# EAGLE design grizzly_bear (EAGLE 7.4.0)
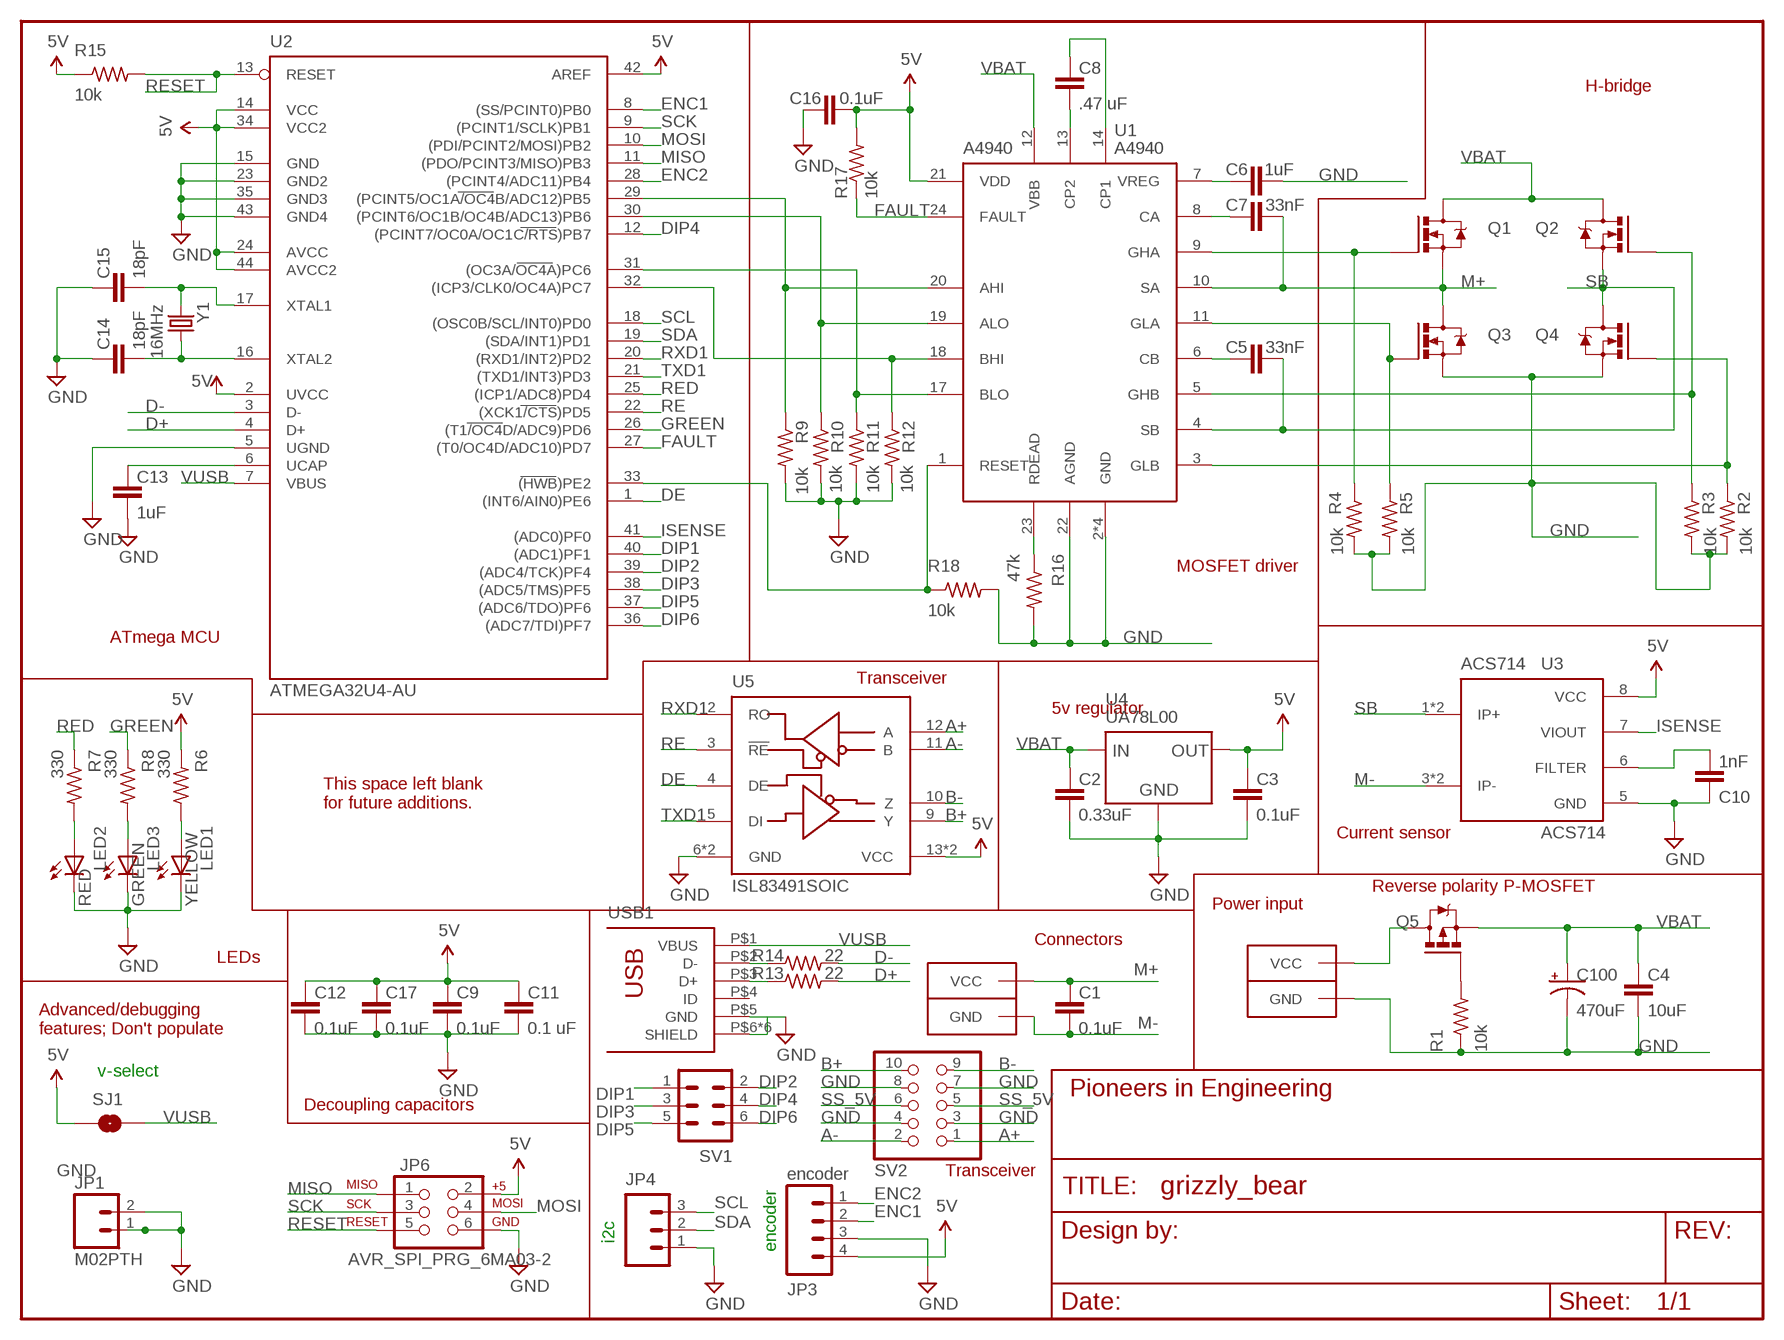
[diagram p0: schematic, sheet 1]
FRAME1 (FRAME-LETTER): AUTHOR: K. Mann, J. Chenn, R. Ou, J. Jacinto, S. Ghosh; REVISION: 4A

## Parts
C1  0.1uF  CAP0603-CAP  [0603-CAP]
C2  0.33uF  CAP0603-CAP  [0603-CAP]
C3  0.1uF  CAP0603-CAP  [0603-CAP]
C4  10uF  CAP1206  [1206]
C5  33nF  CAP0603-CAP  [0603-CAP]
C6  1uF  CAP0603-CAP  [0603-CAP]
C7  33nF  CAP0603-CAP  [0603-CAP]
C8  .47 uF  CAP0603-CAP  [0603-CAP]
C9  0.1uF  CAP0603-CAP  [0603-CAP]
C10  1nF  CAP0603-CAP  [0603-CAP]
C11  0.1 uF  CAP0603-CAP  [0603-CAP]
C12  0.1uF  CAP0603-CAP  [0603-CAP]
C13  1uF  CAP0603-CAP  [0603-CAP]
C14  18pF  CAP0603-CAP  [0603-CAP]
C15  18pF  CAP0603-CAP  [0603-CAP]
C16  0.1uF  CAP0603-CAP  [0603-CAP]
C17  0.1uF  CAP0603-CAP  [0603-CAP]
C100  470uF  CAP_POLG  [PANASONIC_G]
JP1  M02PTH  [1X02]
JP3  encoder  M041X04-MTA  [1X04-MTA]
JP4  M031X03-MTA  [1X03-MTA]
JP6  AVR_SPI_PRG_6MA03-2  [MA03-2]
LED1  YELLOW  LED0805  [LED-0805]
LED2  RED  LED0805  [LED-0805]
LED3  GREEN  LED0805  [LED-0805]
Q1  PSMN4R0  N-CHANNEL-MOSFETSOT669  [SOT669]
Q2  PSMN4R0  N-CHANNEL-MOSFETSOT669  [SOT669]
Q3  PSMN4R0  N-CHANNEL-MOSFETSOT669  [SOT669]
Q4  PSMN4R0  N-CHANNEL-MOSFETSOT669  [SOT669]
Q5  IPD90P03P4L  P-CHANNEL-MOSFETTO252  [TO252]
R1  10k  R-US_R0603  [R0603]
R2  10k  R-US_R0603  [R0603]
R3  10k  R-US_R0603  [R0603]
R4  10k  R-US_R0603  [R0603]
R5  10k  R-US_R0603  [R0603]
R6  330  R-US_R0603  [R0603]
R7  330  R-US_R0603  [R0603]
R8  330  R-US_R0603  [R0603]
R9  10k  R-US_R0603  [R0603]
R10  10k  R-US_R0603  [R0603]
R11  10k  R-US_R0603  [R0603]
R12  10k  R-US_R0603  [R0603]
R13  22  R-US_R0603  [R0603]
R14  22  R-US_R0603  [R0603]
R15  10k  R-US_R0603  [R0603]
R16  47k  R-US_R0603  [R0603]
R17  10k  R-US_R0603  [R0603]
R18  10k  R-US_R0603  [R0603]
SJ1  SOLDERJUMPERNO  [SJ_2S-NO]
SV1  MA03-2  [MA03-2]
SV2  SENSOR_CON_5PINPTH-SHROUDED  [2X5_SHROUDED]
U1  A4940  [24-PIN_TSSOP]
U2  ATMEGA32U4-AU  [TQFP44]
U3  ACS714  [8-PIN_SOIC]
U4  UA78L00  [SOT-89-3]
U5  ISL83491SOIC  [SOIC14]
U$18  ANDERSONVERTICAL  [ANDERSON_VERTICAL]
U$19  ANDERSONVERTICAL  [ANDERSON_VERTICAL]
USB1  USB-OTGMICRO-AB  [USB-MICRO-AB]
Y1  16MHz  CRYSTALSMD  [HC49UP]

## Nets
5V: C3.1 C9.1 C11.2 C12.1 C16.1 C17.1 JP3.4 JP6.2 R6.2 R15.1 R17.2 SJ1.1 U1.21(VDD) U2.2(UVCC) U2.14(VCC) U2.24(AVCC) U2.34(VCC2) U2.42(AREF) U2.44(AVCC2) U3.8(VCC) U4.OUTPUT(OUT) U5.13(VCC) U5.14(VCC)
A+: SV2.1 U5.12(A)
A-: SV2.2 U5.11(B)
AHI: R9.1 U1.20(AHI) U2.29((PCINT5/OC1A/OC4B/ADC12)PB5)
ALO: R10.1 U1.19(ALO) U2.30((PCINT6/OC1B/OC4B/ADC13)PB6)
B+: SV2.10 U5.9(Y)
B-: SV2.9 U5.10(Z)
BHI: R12.1 U1.18(BHI) U2.32((ICP3/CLK0/OC4A)PC7)
BLO: R11.1 U1.17(BLO) U2.31((OC3A/OC4A)PC6)
CA: C7.1 U1.8(CA)
CB: C5.2 U1.6(CB)
CP1: C8.1 U1.14(CP1)
CP2: C8.2 U1.13(CP2)
D+: R13.2 U2.4(D+)
D+-_CON: R13.1 USB1.P$3(D+)
D-: R14.2 U2.3(D-)
D-_CON: R14.1 USB1.P$2(D-)
DE: U2.1((INT6/AIN0)PE6) U5.4(DE)
DIP1: SV1.1 U2.40((ADC1)PF1)
DIP2: SV1.2 U2.39((ADC4/TCK)PF4)
DIP3: SV1.3 U2.38((ADC5/TMS)PF5)
DIP4: SV1.4 U2.12((PCINT7/OC0A/OC1C/RTS)PB7)
DIP5: SV1.5 U2.37((ADC6/TDO)PF6)
DIP6: SV1.6 U2.36((ADC7/TDI)PF7)
DRIVER-RESET: R18.1 U1.1(RESET) U2.33((HWB)PE2)
ENC1: JP3.2 U2.8((SS/PCINT0)PB0)
ENC2: JP3.1 U2.28((PCINT4/ADC11)PB4)
FAULT: R17.1 U1.24(FAULT) U2.27((T0/OC4D/ADC10)PD7)
FILTER: C10.2 U3.6(FILTER)
GHA: Q1.4(G) R4.1 U1.9(GHA)
GHB: Q2.4(G) R3.1 U1.5(GHB)
GLA: Q3.4(G) R5.1 U1.11(GLA)
GLB: Q4.4(G) R2.1 U1.3(GLB)
GND: C2.2 C3.2 C4.1 C6.2 C9.2 C10.1 C11.1 C12.2 C13.2 C14.1 C15.1 C16.2 C17.2 C100.- JP1.1 JP1.2 JP3.3 JP4.1 JP6.6 LED1.C LED2.C LED3.C Q3.1(S) Q3.2(S) Q3.3(S) Q4.1(S) Q4.2(S) Q4.3(S) R1.1 R2.2 R3.2 R4.2 R5.2 R9.2 R10.2 R11.2 R12.2 R16.2 R18.2 SV2.3 SV2.4 SV2.7 SV2.8 U1.2(GND) U1.15(GND) U1.16(GND) U1.22(AGND) U1.PAD(GND) U2.5(UGND) U2.15(GND) U2.23(GND2) U2.35(GND3) U2.43(GND4) U3.5(GND) U4.COMMON(GND) U5.6(GND) U5.7(GND) U$18.PIN1(GND) USB1.P$5(GND) USB1.P$6(SHIELD) USB1.P$7(SHIELD) USB1.P$8(SHIELD) USB1.P$9(SHIELD) USB1.P$10(SHIELD) USB1.P$11(SHIELD)
GREEN: R8.1 U2.26((T1/OC4D/ADC9)PD6)
GREEN-LED: LED3.A R8.2
ISENSE: U2.41((ADC0)PF0) U3.7(VIOUT)
M+: C1.1 C7.2 Q1.1(S) Q1.2(S) Q1.3(S) Q3.MB(D) U1.10(SA) U$19.PIN2(VCC)
M-: C1.2 U3.3(IP-) U3.4(IP-) U$19.PIN1(GND)
MISO: JP6.1 U2.11((PDO/PCINT3/MISO)PB3)
MOSI: JP6.4 U2.10((PDI/PCINT2/MOSI)PB2)
POWER-LED: LED1.A R6.1
RDEAD: R16.1 U1.23(RDEAD)
RE: U2.22((XCK1/CTS)PD5) U5.3(!RE)
RED: R7.1 U2.25((ICP1/ADC8)PD4)
RED-LED: LED2.A R7.2
RESET: JP6.5 R15.2 U2.13(RESET)
RPP-GATE: Q5.1(G) R1.2
RXD1: U2.20((RXD1/INT2)PD2) U5.2(RO)
SB: C5.1 Q2.1(S) Q2.2(S) Q2.3(S) Q4.MB(D) U1.4(SB) U3.1(IP+) U3.2(IP+)
SCK: JP6.3 U2.9((PCINT1/SCLK)PB1)
SCL: JP4.3 U2.18((OSC0B/SCL/INT0)PD0)
SDA: JP4.2 U2.19((SDA/INT1)PD1)
SS_5V: SV2.5 SV2.6
TXD1: U2.21((TXD1/INT3)PD3) U5.5(DI)
UCAP: C13.1 U2.6(UCAP)
VBAT: C2.1 C4.2 C100.+ Q1.MB(D) Q2.MB(D) Q5.2(S) U1.12(VBB) U4.INPUT(IN)
VIN: Q5.3(D) U$18.PIN2(VCC)
VREG: C6.1 U1.7(VREG)
VUSB: SJ1.2 U2.7(VBUS) USB1.P$1(VBUS)
XTAL1: C15.2 U2.17(XTAL1) Y1.2
XTAL2: C14.2 U2.16(XTAL2) Y1.1
Unconnected: USB1.P$4(ID)

## Notes on the sheet
- H-bridge
- MOSFET driver
- ATmega MCU
- Transceiver
- 5v regulator
- This space left blank 
  for future additions.
- Current sensor
- Reverse polarity P-MOSFET
- Power input
- Connectors
- LEDs
- Advanced/debugging 
  features; Don't populate
- v-select
- Decoupling capacitors
- Transceiver
- i2c
- encoder

## Library data of the parts
C1-C17 = pie:CAP: Capacitor Standard 0603 ceramic capacitor, and 0.1" leaded capacitor.; PIE-INT-REF-NUM: CAPACITOR-GENERIC
C100 = pie:CAP_POL: Capacitor Polarized These are standard SMD and PTH capacitors. Normally 10uF, 47uF, and 100uF in electrolytic and tantalum varieties. Always verify the external diameter of the through hole cap, it varies with capacity, voltage, and manufacturer. The EIA devices should be standard.; PIE-INT-REF-NUM: CAPACITOR-GENERIC
JP1 = SparkFun-Connectors:M02: Standard 2-pin 0.1" header. Use with - straight break away headers ( PRT-00116) - right angle break away headers (PRT-00553) - swiss pins (PRT-00743) - machine pins (PRT-00117) - female headers (PRT-00115) Molex polarized connector foot print use with: PRT-08233 with associated crimp pins and housings. 2.54_SCREWTERM for use with PRT-10571. 3.5mm Screw Terminal footprints for PRT-08084 5mm Screw Terminal footprints for use with PRT-08432
JP3 = pie:M04: 4-pin 0.1-inch header and MTA connector; PIE-INT-REF-NUM: MTA
JP4 = pie:M03: 3-pin 0.1-inch header and MTA connector; PIE-INT-REF-NUM: MTA
JP6 = pie:AVR_SPI_PRG_6: AVR ISP 6 Pin This is the reduced ISP connector for AVR programming. Common on Arduino. This footprint will take up less PCB space and can be used with a 10-pin to 6-pin adapter such as SKU: BOB-08508; PIE-INT-REF-NUM: BULK-STOCK
LED1-LED3 = pie:LED: LEDs Standard schematic elements and footprints for 5mm, 3mm, 1206, and 0603 sized LEDs. 5mm - Spark Fun Electronics SKU : COM-00529 (and others); PIE-INT-REF-NUM: LED
Q1-Q4 = pie:N-CHANNEL-MOSFET: N-channel TrenchMOS (TM) logic level FET Source: SOT23-3: http://www.nxp.com/documents/data_sheet/BSS123.pdf SOT669: http://www.nxp.com/documents/data_sheet/PH7030L.pdf; PIE-DIGIKEY-PN-PRI: 568-6738-1-ND; PIE-INT-REF-NUM: NMOS
Q5 = pie:P-CHANNEL-MOSFET: P-Channel PowerTrench® MOSFET Source: FDD4141.pdf; PIE-DIGIKEY-PN-PRI: IPD90P03P4L-04INCT-ND; PIE-INT-REF-NUM: PMOS
R1-R18 = pie:R-US_: RESISTOR, American symbol; PIE-INT-REF-NUM: RESISTOR-GENERIC
SJ1 = pie:SOLDERJUMPER: Solder Jumper Standard SMD solder jumper. Used to automate production. Two varients : Normally Open and Normally Closed are the same, but have different paste layers. NC will have a large amount of paste and should jumper during reflow.; PIE-INT-REF-NUM: DNL
SV1 = pie:MA03-2: PIN HEADER; OC_FARNELL: unknown; OC_NEWARK: unknown; PIE-INT-REF-NUM: BULK-STOCK
SV2 = pie:SENSOR_CON_5PIN
U1 = pie:A4940; PIE-DIGIKEY-PN-PRI: 620-1319-1-ND; PIE-INT-REF-NUM: A4940
U2 = pie:ATMEGA32U4-AU; PIE-DIGIKEY-PN-ALT1: ATMEGA32U4-MURCT-ND; PIE-DIGIKEY-PN-PRI: ATMEGA32U4RC-MURCT-ND; PIE-INT-REF-NUM: ATmega32U4
U3 = pie:ACS714; PIE-DIGIKEY-PN-PRI: 620-1260-1-ND; PIE-INT-REF-NUM: ACS714
U4 = pie:UA78L00; PIE-DIGIKEY-PN-PRI: 296-11118-1-ND; PIE-INT-REF-NUM: UA7805
U5 = pie:ISL83491; PIE-INT-REF-NUM: rs485_491
U$18 U$19 = pie:ANDERSON: 2-pin 25A Anderson Connector http://www.alliedelec.com/images/products/datasheets/bm/ANDERSON_POWER_PRODUCTS/70162018.pdf; PIE-INT-REF-NUM: Anderson
USB1 = pie:USB-OTG: USB Connector OTG connector with ID pin; PIE-DIGIKEY-PN-PRI: H11635CT-ND; PIE-INT-REF-NUM: USB
Y1 = pie:CRYSTAL: Various standard crystals. Proven footprints. Spark Fun Electronics SKU : COM-00534; PIE-INT-REF-NUM: CRYSTAL

## Board
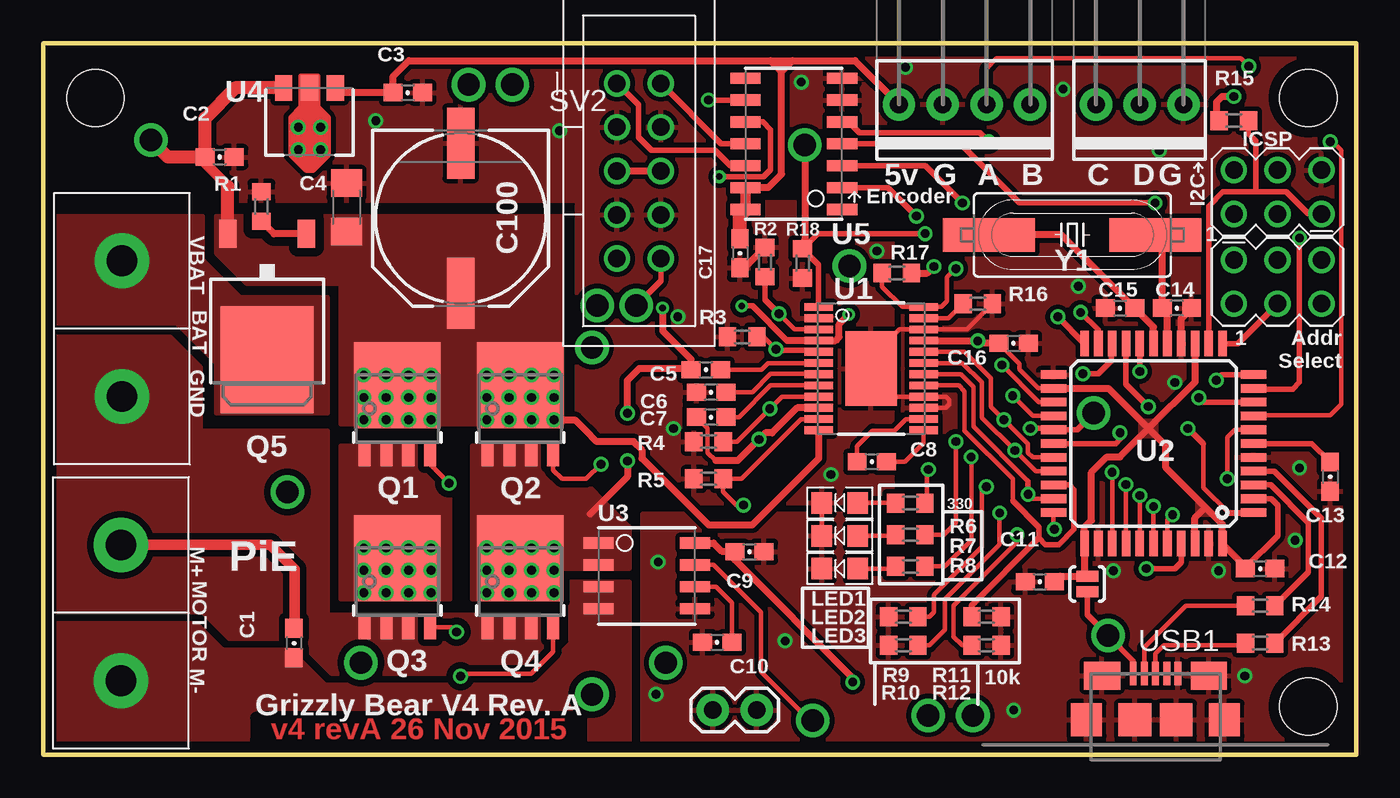
[diagram p1: board, top side]
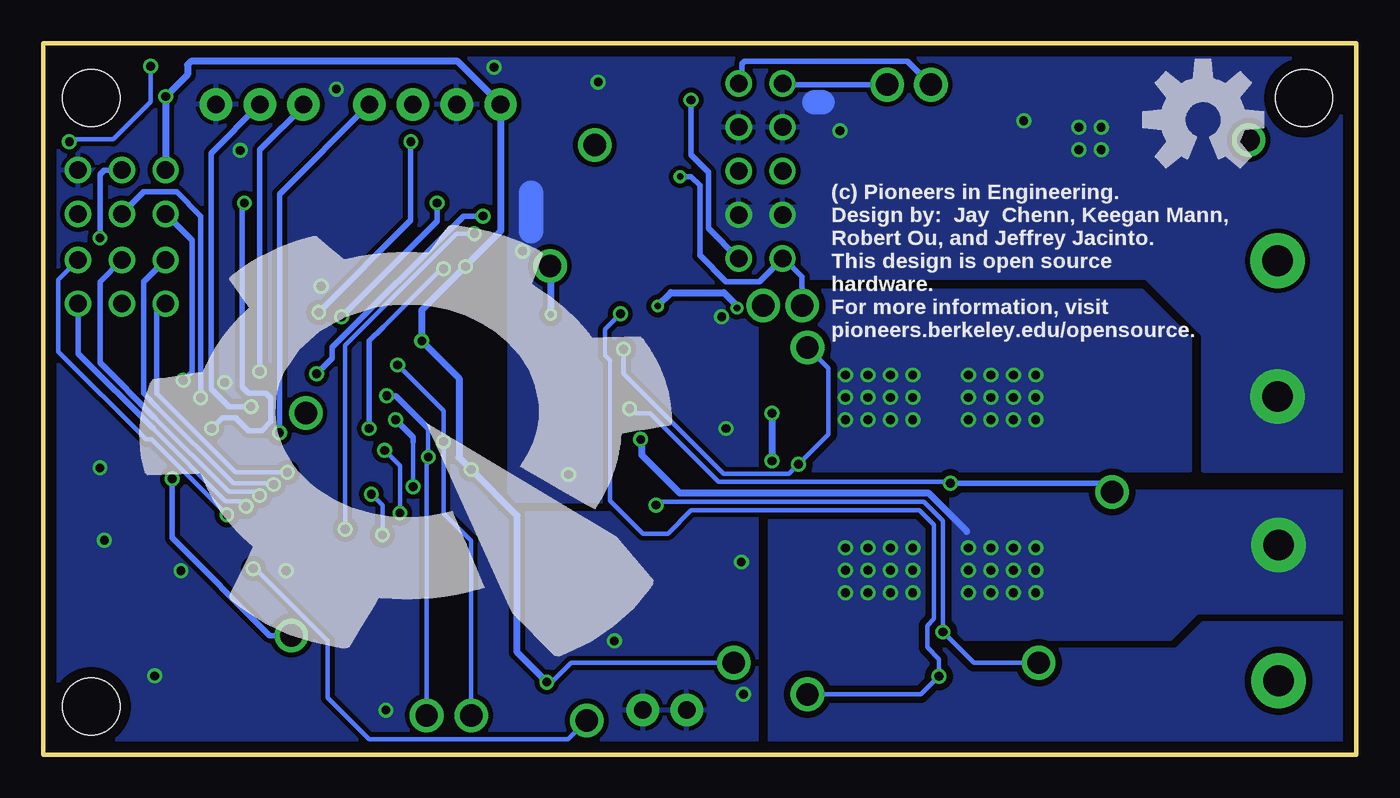
[diagram p2: board, bottom side, seen from below]

Size 76.2 x 41.27 mm. Coordinates in mm from the lower left corner, seen from the top.
Outline: 0,0 76.2,0 76.2,41.27 0,41.27 0,0
Copper layers (1*16): Top 2mil / dielectric 9mil / Bottom 2mil
Design rules "advancedcircuits-33each-pie": minimum track width 6mil, minimum drill 15mil, track to track 6mil, track to pad 6mil, pad to pad 6mil, via to via 6mil, smd to smd 6mil, copper to edge 25mil, drill to drill 7mil, minimum pad ring 7mil, minimum via ring 7mil, stop-mask expansion 3mil, vias tented up to drill 21mil, thermal gap 10mil
tRestrict: area 50.9,20.4 to 51.4,20.5

### Footprints (pad centres in the part's own frame; a part is rotated, then mirrored left to right if it is on the bottom)
0603-CAP = smd 1.1 x 1: 1 -0.85,0; 2 0.85,0
1206 = smd 1.6 x 1.8: 1 -1.4,0; 2 1.4,0
PANASONIC_G = smd 4.1 x 1.6: + 4.35,0; - -4.35,0
1X02 = drill 1.016 pad 1.88: 1 0,0; 2 2.54,0
1X04-MTA = drill 1.016 pad 1.88: 1 -3.81,0; 2 -1.27,0; 3 1.27,0; 4 3.81,0
1X03-MTA = drill 1.016 pad 1.88: 1 -2.54,0; 2 0,0; 3 2.54,0
MA03-2 = drill 1.016 pad 1.524: 1 -2.54,-1.27; 2 -2.54,1.27; 3 0,-1.27; 4 0,1.27; 5 2.54,-1.27; 6 2.54,1.27
LED-0805 = smd 1.194 x 1.245: A -1.041,0; C 1.041,0
SOT669 = smd 0.7 x 1.4: 1 -1.905,-2.65; 2 -0.635,-2.65; 3 0.635,-2.65; 4 1.905,-2.65 | smd 5 x 5: MB 0,1.35
TO252 = smd 1 x 1.6: 1 -2.28,-4.8; 2 2.28,-4.8 | smd 5.4 x 6.2: 3 0,2.5
R0603 = smd 1 x 1.1: 1 -0.85,0; 2 0.85,0
SJ_2S-NO = smd 0.635 x 1.27: 1 -0.45,0; 2 0.45,0
STAND-OFF = hole 3.302: 0,0
2X5_SHROUDED = drill 1.016 pad 1.524: 1 -5.08,-1.27; 2 -5.08,1.27; 3 -2.54,-1.27; 4 -2.54,1.27; 5 0,-1.27; 6 0,1.27; 7 2.54,-1.27; 8 2.54,1.27; 9 5.08,-1.27; 10 5.08,1.27
24-PIN_TSSOP = smd 1.65 x 0.45: 1 -3.05,3.575; 2 -3.05,2.925; 3 -3.05,2.275; 4 -3.05,1.625; 5 -3.05,0.975; 6 -3.05,0.325; 7 -3.05,-0.325; 8 -3.05,-0.975; 9 -3.05,-1.625; 10 -3.05,-2.275; 11 -3.05,-2.925; 12 -3.05,-3.575; 13 3.05,-3.575; 14 3.05,-2.925; 15 3.05,-2.275; 16 3.05,-1.625; 17 3.05,-0.975; 18 3.05,-0.325; 19 3.05,0.325; 20 3.05,0.975; 21 3.05,1.625; 22 3.05,2.275; 23 3.05,2.925; 24 3.05,3.575 | smd 3 x 4.32: PAD 0,0
TQFP44 = smd 1.5 x 0.5: 1 -5.8,4; 2 -5.8,3.2; 3 -5.8,2.4; 4 -5.8,1.6; 5 -5.8,0.8; 6 -5.8,0; 7 -5.8,-0.8; 8 -5.8,-1.6; 9 -5.8,-2.4; 10 -5.8,-3.2; 11 -5.8,-4; 23 5.8,-4; 24 5.8,-3.2; 25 5.8,-2.4; 26 5.8,-1.6; 27 5.8,-0.8; 28 5.8,0; 29 5.8,0.8; 30 5.8,1.6; 31 5.8,2.4; 32 5.8,3.2; 33 5.8,4 | smd 0.5 x 1.5: 12 -4,-5.8; 13 -3.2,-5.8; 14 -2.4,-5.8; 15 -1.6,-5.8; 16 -0.8,-5.8; 17 0,-5.8; 18 0.8,-5.8; 19 1.6,-5.8; 20 2.4,-5.8; 21 3.2,-5.8; 22 4,-5.8; 34 4,5.8; 35 3.2,5.8; 36 2.4,5.8; 37 1.6,5.8; 38 0.8,5.8; 39 0,5.8; 40 -0.8,5.8; 41 -1.6,5.8; 42 -2.4,5.8; 43 -3.2,5.8; 44 -4,5.8
8-PIN_SOIC = smd 1.75 x 0.65: 1 -2.8,1.905; 2 -2.8,0.635; 3 -2.8,-0.635; 4 -2.8,-1.905; 5 2.8,-1.905; 6 2.8,-0.635; 7 2.8,0.635; 8 2.8,1.905
SOT-89-3 = smd 1 x 1.5: COMMON 0,-1.995; INPUT 1.5,-1.995; OUTPUT -1.5,-1.995
SOIC14 = smd 1.75 x 0.65: 1 -2.8,3.81; 2 -2.8,2.54; 3 -2.8,1.27; 4 -2.8,0; 5 -2.8,-1.27; 6 -2.8,-2.54; 7 -2.8,-3.81; 8 2.8,-3.81; 9 2.8,-2.54; 10 2.8,-1.27; 11 2.8,0; 12 2.8,1.27; 13 2.8,2.54; 14 2.8,3.81
ANDERSON_VERTICAL = drill 1.778 pad 3.175: PIN1 0,-3.937; PIN2 0,3.937
USB-MICRO-AB = smd 0.4 x 1.35: P$1 -1.3,1; P$2 -0.65,1; P$3 0,1; P$4 0.65,1; P$5 1.3,1 | smd 2.1 x 1.6: P$6 -3.1,0.875; P$7 3.1,0.875 | smd 1.8 x 1.9: P$8 -4,-1.675; P$9 4,-1.675 | smd 1.9 x 1.9: P$10 -1.2,-1.675; P$11 1.2,-1.675
HC49UP = smd 5.334 x 1.93: 1 -4.826,0; 2 4.826,0

### Placement (x,y rotation side)
C1  14.55,6.48 270 top
C2  10.24,34.67 0 top
C3  21.16,38.41 0 top
C4  17.6,31.75 270 top
C5  38.46,22.33 0 top
C6  38.76,21.03 180 top
C7  38.76,19.58 180 top
C8  48.08,17 0 top
C9  40.99,11.77 0 top
C10  39.11,6.52 0 top
C11  57.83,10.03 0 top
C12  70.61,10.79 0 top
C13  74.68,16.13 270 top
C14  65.79,25.91 180 top
C15  62.48,25.91 0 top
C16  56.31,23.86 0 top
C17  40.44,29.08 270 top
C100  24.23,31.11 270 top
JP1  38.86,2.59 0 top
JP3  53.47,37.72 180 top
JP4  63.63,37.72 180 top
JP6  71.63,32.64 0 top
LED1  46.23,14.61 180 top
LED2  46.23,12.7 180 top
LED3  46.23,10.79 180 top
Q1  20.56,20.07 0 top
Q2  27.69,20.07 0 top
Q3  20.56,10.04 0 top
Q4  27.69,10.04 0 top
Q5  13,25.42 180 top
R1  12.67,31.8 270 top
R2  41.88,28.57 90 top
R3  40.56,24.23 180 top
R4  38.61,18.16 180 top
R5  38.61,16 180 top
R6  50.32,14.6 0 top
R7  50.32,12.76 180 top
R8  50.32,10.92 180 top
R9  49.91,8 180 top
R10  49.91,6.35 180 top
R11  54.74,8 0 top
R12  54.74,6.35 0 top
R13  70.61,6.48 0 top
R14  70.61,8.64 0 top
R15  69.09,36.78 0 top
R16  54.23,26.16 0 top
R17  49.53,27.94 0 top
R18  44.07,28.5 270 top
SJ1  60.58,9.91 270 top
STANDOFF1  STAND-OFF  [STAND-OFF]  3.05,38.1 0 top
STANDOFF2  STAND-OFF  [STAND-OFF]  73.41,2.79 0 top
STANDOFF3  STAND-OFF  [STAND-OFF]  73.41,38.1 0 top
SV1  71.63,27.43 180 top
SV2  34.57,33.86 270 top
U1  48.04,22.39 0 top
U2  64.43,18.05 180 top
U3  35.02,10.37 0 top
U4  15.46,36.68 180 top
U5  43.56,35.43 180 top
U$1  [OSHW-LOGO-L]  8.89,36.83 0 bottom
U$17  [PIE-LOGO]  54.1,19.05 0 bottom
U$18  4.57,24.71 0 top
U$19  4.52,8.23 0 top
USB1  64.54,3.71 0 top
Y1  59.72,30.15 180 top

### Tracks (layer width: path | path; a pad name or v marks a point on that pad's centre or on a via)
5V  (via drill 0.51, 1.3)
  Top 0.254: R6.2 51.29,14.6 51.29,16.47 v51.36,16.55 | C16.1 56.64,22.68 56.64,22.35 57.74,21.25 58.07,21.25
  Top 0.305: U2.2 71.26,14.85 71.63,14.48 71.63,12.7 69.76,10.83 C12.1
  Top 0.406: U3.8 38.91,12.28 39.37,11.81 40.1,11.81 C9.1 40.14,11.3 46.97,4.46 v46.97,4.21 | 64.14,18.92 61.81,21.25 U2.24 58.07,21.25 | 64.14,18.92 62.48,17.27 61.72,17.27 60.83,16.38 60.83,13.59 60.43,13.18 U2.34 60.43,10.51 SJ1.1 59.01,10.36 C11.2 | U2.42 66.83,13.74 67.44,14.35 | 67.44,14.35 65.15,16.64 65.15,17.91 64.14,18.92 | 67.44,14.35 68.43,13.36 U2.44 69.76,10.92 C12.1 | U2.14 66.83,21.62 64.14,18.92 | R17.2 51.31,27.94 v51.69,28.32 | C16.1 54.37,23.86 v54.23,24 54.21,24.02 U1.21 | 42.85,39.62 42.85,33.68 42.06,32.89 U5.13 | 42.85,39.62 42.85,40.13 | 42.22,40.26 21.21,40.26 20.31,39.36 C3.1 17.22,38.41 U4.OUTPUT | 43.48,40.26 47.12,40.26 JP3.4 | 42.22,40.26 43.48,40.26 | 43.48,40.26 42.85,39.62 | 42.85,39.62 42.22,40.26 | v69.09,38.18 68.4,38.18 68.07,37.85 68.07,36.95 R15.1
  Top 0.61: U5.13 U5.14
  Top 0.813: C17.1 40.44,31.3 U5.14
  Bottom 0.254: v46.97,4.21 46.69,4.21 45.57,5.33 v36.12,5.33
  Bottom 0.406: 51.62,16.8 v51.36,16.55 | v51.36,16.55 52.07,17.25 52.07,21.84 v54.23,24 54.23,25.78 v51.69,28.32 49.66,30.35 JP3.4 52.15,40.21 67.61,40.21 67.82,40.01 67.82,39.45 v69.09,38.18 JP6.2 | v51.36,16.55 48.69,13.87 48.69,5.93 v46.97,4.21
  pour Top: 63.75,19.3 64.52,19.3 64.52,18.54 63.75,18.54
  pour Top: 67.06,14.73 67.82,13.97 67.06,13.97
A+  (via drill 1.3)
  Top 0.305: SV2.1 34.54,37.69 34.54,35.81 35.31,35.05 38.99,35.05 39.88,34.16 U5.12
  Bottom 0.305: v27.23,38.86 33.22,38.86 SV2.1
A-  (via drill 1.3)
  Top 0.305: U5.11 39.34,35.43 SV2.2
  Bottom 0.305: SV2.2 35.66,39.12 35.66,40.08 35.51,40.23 26.06,40.23 v24.69,38.86
AHI  (via drill 0.51)
  Top 0.254: U1.20 53.47,23.37 54.99,21.84 54.99,20.19 v55.75,19.43 57.15,18.03 57.15,17.53 57.43,17.25 U2.29 | R9.1 51.44,8 51.69,8.26 51.69,9.27 54.48,12.06 54.48,15.29 v54.74,15.54
  Bottom 0.254: v54.74,15.54 54.74,18.16
  Bottom 0.305: 54.74,18.16 54.74,18.41 v55.75,19.43
ALO  (via drill 0.51)
  Top 0.254: U1.19 53.35,22.72 54.48,21.59 54.48,19.56 v56.39,17.65 57.59,16.45 U2.30 | v55.5,14.02 55.5,12.19 52.32,9.02 52.32,7.24 51.44,6.35 R10.1
  Bottom 0.254: v55.5,14.02 55.5,16.76 v56.39,17.65
B+  (via drill 0.51, 1.3)
  Top 0.305: v38.61,37.97 U5.9 | SV2.10 35.84,27.48 v34.42,26.06
  Bottom 0.305: v38.61,37.97 38.61,34.8 37.59,33.78 37.59,30.53 SV2.10
B-  (via drill 0.38, 1.3)
  Top 0.305: U5.10 41.76,36.7 42.22,36.25 42.22,33.93 41.81,33.53 v39.24,33.53
  Bottom 0.305: v39.24,33.53 38.61,33.53 38.1,33.02 38.1,28.96 36.58,27.43 34.65,27.43 SV2.9 33.2,28.78 32.16,27.74 v32.16,26.06
BHI  (via drill 0.51)
  Top 0.254: U1.18 53.24,22.07 53.98,21.34 53.98,19.05 57.15,15.88 | R12.1 53.34,6.35 52.83,6.86 52.83,8.64 56.52,12.32 v56.52,12.75 | U2.32 57.41,14.85 v57.15,15.11
  Top 0.305: 57.15,15.88 v57.15,15.11
  Bottom 0.254: v56.52,12.75 56.52,14.48 v57.15,15.11
BLO
  Top 0.254: U1.17 53.13,21.42 53.47,21.08 53.47,18.8 56.26,16 56.26,14.73
  Top 0.305: 53.89,8.04 R11.1 53.89,8.42 53.85,8.46 53.85,8.64 57.78,12.57 | 57.78,12.57 57.78,13.21 56.26,14.73 | 57.78,12.57 58.17,12.19 58.93,12.19 59.82,13.08 59.82,15.37 59.53,15.65 U2.31 58.73,15.75 59.18,15.75
CA
  Top 0.254: U1.8 42.22,21.42 40.38,19.58 C7.1
CB
  Top 0.254: C5.2 41.68,22.33 42.06,22.71 44.98,22.71 U1.6
CP1
  Top 0.254: C8.1 47.23,17.9 48.13,18.8 49.4,18.8 50.08,19.47 U1.14
CP2
  Top 0.254: C8.2 50.02,17 51.09,18.07 U1.13
D+
  Top 0.305: U2.4 71.43,16.45 74.17,13.72 74.17,9.18 R13.2
D+-_CON
  Top 0.254: USB1.P$3 64.54,5.87 65.02,6.35 69.64,6.35 R13.1
D-
  Top 0.305: U2.3 71.22,15.65 73.41,13.46 73.41,10.58 R14.2
D-_CON
  Top 0.254: USB1.P$2 63.89,6.23 66.29,8.64 R14.1
DE  (via drill 0.51)
  Top 0.254: 67.31,18.03 67.31,15.49 68.75,14.05 | 68.75,14.05 U2.1 70.15,13.97 68.83,13.97 68.75,14.05
  Top 0.305: v64.52,32 56.64,32 53.21,35.43 U5.4 | v66.42,18.92 67.31,18.03
  Bottom 0.305: v64.52,32 64.64,31.88 64.64,21.34 64.26,20.95 63.25,20.95 62.99,20.7 62.99,19.3 63.5,18.8 64.26,18.8 65.02,19.56 65.79,19.56 v66.42,18.92
DIP1  (via drill 0.51)
  Top 0.254: U2.40 65.23,13.62 v65.53,13.92
  Bottom 0.254: v65.53,13.92 69.9,18.29 70.23,18.29 75.31,23.37 75.31,27.56 SV1.1
DIP2  (via drill 0.51)
  Top 0.254: U2.39 v64.43,14.4
  Bottom 0.254: 69.83,18.92 65.61,14.71 64.73,14.71 v64.43,14.4
  Bottom 0.305: 69.83,18.92 74.17,23.27 SV1.2
DIP3  (via drill 0.51)
  Top 0.254: U2.38 v63.63,15.04
  Bottom 0.254: 69.72,19.56 65.41,15.24 63.83,15.24 v63.63,15.04
  Bottom 0.305: 69.72,19.56 72.9,22.73 72.9,27.43 SV1.3
DIP4
  Top 0.305: U2.12 69.32,23.85 SV1.4
DIP5  (via drill 0.51)
  Top 0.254: U2.37 v62.83,15.67
  Bottom 0.254: 69.6,20.19 65.15,15.75 62.9,15.75 v62.83,15.67
  Bottom 0.305: 69.6,20.19 70.36,20.95 70.36,27.43 SV1.5
DIP6  (via drill 0.51)
  Top 0.254: U2.36 v62.03,16.38
  Bottom 0.254: v62.03,16.38 65.02,16.38 69.6,20.95
  Bottom 0.305: 69.6,20.95 69.6,25.65 SV1.6
DRIVER-RESET  (via drill 0.51, 1.3)
  Top 0.254: U2.33 58.63,13.13 v58.67,13.08
  Top 0.305: v51.18,30.23 44.95,30.23 R18.1 44.99,28.43 U1.1
  Top 0.406: v44.2,35.36 44.2,29.87 44.35,29.72 44.2,29.72 44.2,29.48 R18.1
  Bottom 0.254: v58.67,13.08 58.67,23.75 52.2,30.23 v51.18,30.23
ENC1  (via drill 0.51)
  Top 0.254: 70.26,19.68 74.68,19.68 75.31,20.32 75.31,35.05 74.8,35.56 v74.68,35.56 | JP3.2 54.74,39.8 55.32,40.39 69.49,40.39 v69.95,39.93
  Top 0.305: 70.26,19.68 U2.8
  Bottom 0.254: v74.68,35.56 74.55,35.69 72.14,35.69 70.67,37.15 70.48,37.34 69.95,37.87 v69.95,39.93
ENC2  (via drill 0.51)
  Top 0.305: v62.48,18.67 62.48,18.29 62.23,18.03 58.64,18.03 U2.28
  Bottom 0.305: JP3.1 62.48,32.51 v62.48,18.67
FAULT  (via drill 0.51, 1.3)
  Top 0.254: R17.1 48.68,27.14 49.85,25.97 U1.24 52.13,25.97 52.45,26.29 52.45,27.69 v52.96,28.19
  Top 0.305: v57.28,18.92 58.55,18.92 U2.27 60,18.85 v60.96,19.81
  Bottom 0.254: 56.52,24.77 53.09,28.19 v52.96,28.19
  Bottom 0.305: 56.52,24.77 57.28,24 v57.28,18.92
FILTER
  Top 0.254: C10.2 39.96,8.8 39.03,9.73 U3.6
GHA  (via drill 0.51, 1.3)
  Top 0.254: U1.9 42.87,20.77 v42.16,20.07 40.26,18.16 R4.1 | Q1.4 22.46,16.84 v23.55,15.75
  Bottom 0.254: v42.16,20.07 41.91,19.81 41,19.81 37.02,15.83 23.63,15.83 v23.55,15.75
  Bottom 0.305: v23.55,15.75 14.69,15.75 v14.17,15.24
GHB  (via drill 0.51, 1.3)
  Top 0.254: Q2.4 29.6,16.5 30.1,16 31.52,16 v32.37,16.86 | R3.1 41.81,24.23 v42.52,23.52
  Top 0.305: v42.52,23.52 42.62,23.52 42.67,23.47 44.89,23.47 U1.5
  Bottom 0.254: v31.85,23.62 30.63,22.4 30.63,18.59 v32.37,16.86 32.92,16.31 36.73,16.31 42.52,22.1 v42.52,23.52
GLA  (via drill 0.51, 1.3)
  Top 0.254: Q3.4 23.71,7.39 v23.99,7.12 | U1.11 43.98,19.47 40.51,16 R5.1 39.46,15.24 40.22,14.48 v40.64,14.48
  Bottom 0.254: v40.64,14.48 40.44,14.68 25.09,14.68 23.99,13.58 v23.99,7.12 22.2,5.33 v18.44,5.33
GLB  (via drill 0.51, 1.3)
  Top 0.254: U1.3 43.6,24.67 v42.7,25.58 | Q4.4 29.6,5.97 28.32,4.7 24.37,4.7 v24.22,4.55
  Top 0.305: R2.1 41.88,26.39 v42.7,25.58
  Bottom 0.254: v31.85,3.5 25.26,3.5 v24.22,4.55 24.22,5.55 24.89,6.22 24.89,7.49 24.51,7.87 24.51,13.34 25.35,14.17 38.61,14.17 39.95,12.83 41.4,12.83 43.31,14.73 43.31,22.89 43.59,23.16 43.59,24.69 v42.7,25.58
GND  (via drill 0.51)
  Top 0.254: U1.15 52.38,20.12 52.58,20.32 52.58,20.57 52.38,20.77 U1.16 48.57,20.77 48.13,21.21 48.13,22.3 U1.PAD 48.9,23.25 48.9,23.88 49.69,24.67 U1.22 53.59,24.67 R16.2 | v14.81,35.1 v14.81,36.4 v16.11,36.4 v16.11,35.1 | LED1.C LED2.C
  Top 0.406: U2.15 66.03,25.3 C14.1 | R2.2 40.69,28.23 C17.2
  Bottom 1.422: 31.45,37.85 30.99,37.85 | 47.88,32.59 47.88,30.35
  other vias: 19.3,36.77 36.83,25.4 36.58,18.92 45.72,16.26 48.39,29.21 60.07,27.18 72.64,12.45 72.9,16.64 62.1,10.67 56.31,2.59 69.72,4.57 68.2,10.67 65.66,21.59 29.97,36.2 43.05,6.6 35.69,11.18 50.04,39.88 43.99,39.01 64.77,35.05 59.18,38.61 35.56,3.51
  pour Top (isolate 0.381, no thermals): 7.37,24.26 0,24.26 0,8.26 9.27,8.26 10.79,6.73 14.71,6.73 16.74,4.7 27.43,4.7 28.96,6.22 28.96,8.13 16.51,8.13 16.51,18.8 9.14,18.8 9.14,22.48
  pour Top (isolate 0.279): 30.99,32 30.99,17.78 34.16,14.61 49.28,14.61 49.28,32
  pour Bottom (isolate 0.279, no thermals): 34.8,27.69 12.19,27.69 8.89,24.38 8.89,16.51 0,16.51 0,41.27 31.24,41.27 31.24,31.75 49.15,31.75 49.15,14.73 34.8,14.73
  pour Top (isolate 0.279): 76.2,0 34.8,0 34.8,13.97 49.91,13.97 49.91,32.13 0,32.13 0,41.27 76.2,41.27
  pour Bottom (isolate 0.279): 76.2,0 34.8,0 34.8,13.97 49.91,13.97 49.91,31.5 31.24,31.5 31.22,41.27 76.2,41.27
GREEN  (via drill 0.51, 1.3)
  Top 0.254: 58.84,19.65 U2.26 57.44,19.65 v56.26,20.83 | R8.1 52.32,10.92 53.85,12.45 v53.85,17.27
  Bottom 0.254: 53.85,18.92 v53.85,17.27 53.95,17.17 v53.95,2.29
  Bottom 0.305: 53.85,18.92 55.75,20.83 v56.26,20.83
GREEN-LED
  Top 0.254: LED3.A 49.34,10.79 R8.2
ISENSE  (via drill 0.51, 1.3)
  Top 0.254: U3.7 38.91,11.01 41.66,8.26 41.66,4.83 44.5,1.98 v44.65,1.98
  Top 0.305: U2.41 66.03,11.16 65.66,10.79 v64.01,10.79
  Bottom 0.254: v64.01,10.79 63.88,10.79 59.69,6.6 59.69,3.3 57.28,0.89 45.74,0.89 v44.65,1.98
M+  (via drill 0.51)
  Top 0.254: 39.01,17.07 38.56,17.53 38.56,18.94 C7.2
  Top 0.406: U1.10 43.74,20.12 42.29,18.67 41.91,18.67 v41.53,18.29 40.31,17.07 39.01,17.07
  Top 0.61: U$19.PIN2 13.18,12.17 14.61,10.74 14.61,7.38 C1.1
  Bottom 0.406: 22.61,12.95 24.84,15.19 39.27,15.19 41.45,17.37 41.45,18.21 v41.53,18.29
  other vias: 19.91,9.39 21.21,9.39 22.51,9.39 18.61,10.7 19.91,10.7 21.21,10.7 22.51,10.7 18.61,11.99 19.91,11.99 21.21,11.99 22.51,11.99 18.61,9.39
  pour Top (isolate 0.381, no thermals): 17.27,17.91 17.27,9.02 23.62,9.02 23.62,17.91
  pour Bottom (isolate 0.381, no thermals): 23.5,15.24 0,15.24 0,8.26 9.27,8.26 10.79,6.73 23.5,6.73
M-
  pour Top (isolate 0.381, no thermals): 0,7.62 8.89,7.62 10.41,6.1 14.33,6.1 16.36,4.06 28.19,4.06 30.61,6.48 30.61,10.03 34.04,10.03 34.04,0 0,0
MISO  (via drill 0.51)
  Top 0.305: U2.11 68.41,22.05 v68.07,21.72
  Bottom 0.305: v68.07,21.72 67.56,22.23 67.56,29.84 JP6.1
MOSI  (via drill 0.51)
  Top 0.305: v72.9,29.97 72.9,21.59 72.52,21.21 70.27,21.21 U2.10
  Bottom 0.305: JP6.4 72.64,33.91 72.9,33.66 v72.9,29.97
POWER-LED
  Top 0.254: LED1.A 49.45,14.61 R6.1
RDEAD
  Top 0.254: U1.23 52.54,25.32 R16.1
RE  (via drill 0.51)
  Top 0.305: U2.22 v58.88,25.4 | v53.34,32 51.18,34.16 U5.3
  Bottom 0.305: v53.34,32 53.34,30.94 v58.88,25.4
RED  (via drill 0.51, 1.3)
  Top 0.254: 51.16,12.68 R7.1 52.25,12.76 52.96,13.46 v52.96,18.16 | v55.63,22.61 57.78,20.45 U2.25
  Bottom 0.254: v55.63,22.61 52.96,19.94 v52.96,18.16 52.96,14.02 51.36,12.42 v51.36,2.29
RED-LED
  Top 0.254: LED2.A 49.41,12.7 R7.2
RESET
  Top 0.305: 70.36,32.64 70.36,35.6 69.94,36.02 R15.2 | JP6.5 73.41,31.37 72.14,32.64 70.36,32.64 | U2.13 67.63,31.81 68.45,32.64 70.36,32.64
RPP-GATE
  Top 0.406: Q5.1 13.4,30.22 R1.2
RXD1  (via drill 0.51)
  Top 0.305: U2.20 61.98,23.8 61.98,22.86 61.21,22.1 v60.33,22.1 | v50.67,31.24 49.02,32.89 U5.2
  Bottom 0.305: v60.33,22.1 59.44,22.99 59.44,23.62 51.82,31.24 v50.67,31.24
SB  (via drill 0.38, 0.51, 1.3)
  Top 0.305: v40.54,26.04 41.15,26.04 43.16,24.02
  Top 0.406: 43.16,24.02 U1.4 45.97,24.02 46.18,24.23 46.18,24.97 v46.74,25.53 | v33.91,17.04 33.91,16.13 31.75,13.97 | v33.91,19.81 33.91,21.72 34.59,22.4 37.53,22.4 C5.1 37.61,22.94 35.97,24.57 35.97,25.88 v35.94,25.91
  Bottom 0.406: v40.54,26.04 39.78,26.8 36.7,26.8 35.94,26.04 v35.94,25.91 | v33.91,19.81 v33.91,17.04 | v46.74,25.53 46.74,28.3 v46.79,28.35
  other vias: 29.64,11.99 29.64,9.39 25.74,11.99 28.34,11.99 27.04,11.99 25.74,9.39 25.74,10.7 29.64,10.7 28.34,10.7 27.04,10.7 27.04,9.39 28.34,9.39
  pour Top (isolate 0.381, no thermals): 24.89,9.02 24.89,17.91 30.23,17.91 30.23,17.02 34.04,13.21 34.04,10.79 29.97,10.79 29.97,9.02
  pour Bottom (isolate 0.381): 0,7.62 8.89,7.62 10.41,6.1 24.38,6.1 24.38,15.37 34.04,15.37 34.04,0 0,0
SCK  (via drill 0.51)
  Top 0.305: v67.06,20.7 67.31,20.45 U2.9
  Bottom 0.305: v67.06,20.7 67.06,31.24 68.45,32.64 70.36,32.64 JP6.3
SCL  (via drill 0.51)
  Top 0.305: U2.18 v63.63,22.23
  Bottom 0.254: 61.04,37.67 JP4.3
  Bottom 0.305: 61.04,37.67 63.63,35.08 v63.63,22.23
SDA  (via drill 0.51)
  Top 0.305: U2.19 62.83,21.5 v64.14,20.19
  Bottom 0.305: v64.14,20.19 65.41,20.19 66.45,21.23 66.45,34.9 JP4.2
SS_5V
  Top 0.406: SV2.5 SV2.6
TXD1  (via drill 0.51)
  Top 0.305: U2.21 61.21,23.86 61.21,24.64 v60.2,25.65 | v54.86,35.56 54.36,36.07 47.37,36.07 46.74,36.7 U5.5
  Bottom 0.305: v60.2,25.65 54.86,30.99 v54.86,35.56
UCAP
  Top 0.305: U2.6 73.61,18.05 C13.1
VBAT  (via drill 0.51, 1.3)
  Top 0.254: 31.49,18.79 31.14,19.14
  Top 0.406: v29.64,19.43 30.86,19.43 31.49,18.79 32.12,18.16 34.27,18.16 34.75,17.68 34.75,17.2 38.61,13.34 41.15,13.34 44.99,17.18 U1.12 | 10.72,32.97 10.61,33.08
  Top 0.61: C2.1 9.39,34.3 10.61,33.08
  Top 0.762: U4.INPUT 11.14,38.67 9.39,36.92 C2.1 7.24,34.67 v6.25,35.66 | Q5.2 10.72,32.97
  other vias: 18.61,20.73 19.91,20.73 21.21,20.73 22.51,20.73 18.61,19.43 19.91,19.43 21.21,19.43 22.51,19.43 25.74,22.02 27.04,22.02 28.34,22.02 29.64,22.02 25.74,20.73 27.04,20.73 28.34,20.73 29.64,20.73 18.61,22.02 19.91,22.02 21.21,22.02 22.51,22.02 25.74,19.43 27.04,19.43 28.34,19.43
  pour Top (isolate 0.508, no thermals): 30.1,19.18 17.27,19.18 17.27,27.3 11.81,27.3 10.03,29.08 10.03,31.24 30.1,31.24
  pour Bottom (isolate 0.381): 34.04,16.51 34.04,26.92 12.45,26.92 9.65,24.13 9.65,16.51
VIN
  pour Top (isolate 0.381, no thermals): 0,31.24 0,25.02 7.75,25.02 10.03,22.73 10.03,19.81 16.51,19.81 16.51,26.54 11.43,26.54 9.27,28.7 9.27,31.24
VREG
  Top 0.254: C6.1 41.15,21.03 42.22,22.1 44.96,22.1 U1.7
VUSB  (via drill 0.51, 1.3)
  Top 0.254: U2.7 69.14,18.85 68.71,18.41 v68.71,16
  Top 0.305: USB1.P$1 63.24,5.47 v61.8,6.91 60.58,8.13 SJ1.2
  Top 0.406: 60.58,9.4 SJ1.2
  Bottom 0.254: 68.71,12.7 68.71,12.57
  Bottom 0.305: v68.71,16 68.71,12.7 | 68.71,12.57 63.04,6.91 v61.8,6.91
XTAL1
  Top 0.406: Y1.2 59.09,30.15 C15.2 64.43,24.81 U2.17
XTAL2
  Top 0.406: U2.16 65.23,25.62 C14.2 64.94,29.75 Y1.1

### Text on the board
Top: v4 revA 26 Nov 2015
tPlace: ICSP | 5v | G | A | B | C | D | G | Encoder | I2C | 1 | VBAT | BAT | 1 | Addr / Select | GND | 330 | M+ | PiE | MOTOR | M- | 10k | Grizzly Bear V4 Rev. A
bPlace: (c) Pioneers in Engineering. / Design by: Jay Chenn, Keegan Mann, / Robert Ou, and Jeffrey Jacinto. / This design is open source / hardware. / For more information, visit / pioneers.berkeley.edu/opensource.
tValues: Q1-Q4 PSMN4R5